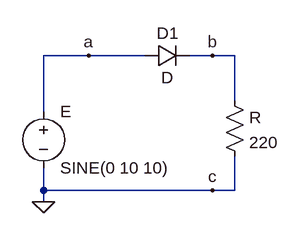
[diagram p0: schematic Draft4.asc]
Draft4.asc, the LTspice schematic file:
Version 4
SHEET 1 880 680
WIRE 112 64 48 64
WIRE 192 64 112 64
WIRE 288 64 256 64
WIRE 320 64 288 64
WIRE 320 128 320 64
WIRE 48 144 48 64
WIRE 48 256 48 224
WIRE 288 256 48 256
WIRE 320 256 320 208
WIRE 320 256 288 256
WIRE 48 272 48 256
FLAG 48 272 0
FLAG 112 64 a
FLAG 288 64 b
FLAG 288 256 c
SYMBOL voltage 48 128 R0
WINDOW 123 0 0 Left 0
WINDOW 39 0 0 Left 0
SYMATTR InstName E
SYMATTR Value SINE(0 10 10)
SYMBOL diode 192 80 R270
WINDOW 0 32 32 VTop 2
WINDOW 3 0 32 VBottom 2
SYMATTR InstName D1
SYMBOL res 304 112 R0
SYMATTR InstName R
SYMATTR Value 220
SYMATTR SpiceLine tol=1 pwr=0.1

The netlist it stands for:
* Draft4.asc
V§E a 0 SINE(0 10 10)
D1 a b D
R b 0 220 tol=1 pwr=0.1
.model D D
.lib standard.dio
.backanno
.end